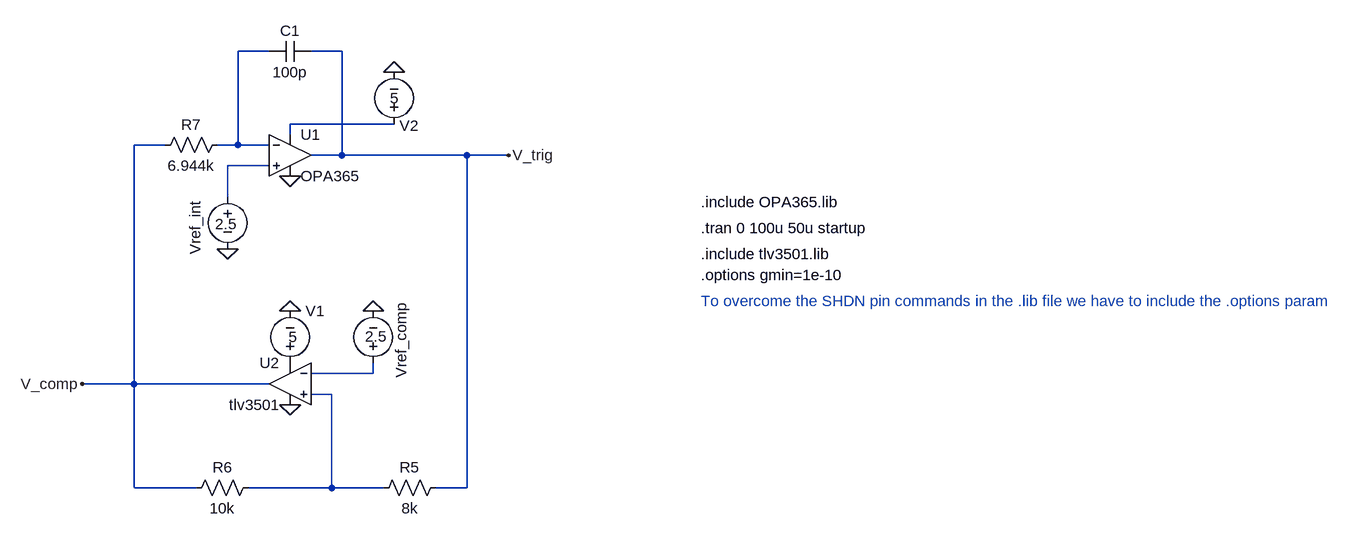
[diagram p0: schematic oscillator.asc]
oscillator.asc, the LTspice schematic file:
Version 4.1
SHEET 1 1908 680
WIRE 192 -64 144 -64
WIRE 304 -64 256 -64
WIRE 384 48 224 48
WIRE 224 64 224 48
WIRE 32 80 -16 80
WIRE 144 80 144 -64
WIRE 144 80 112 80
WIRE 192 80 144 80
WIRE 304 96 304 -64
WIRE 304 96 256 96
WIRE 496 96 304 96
WIRE 560 96 496 96
WIRE 192 112 128 112
WIRE 128 160 128 112
WIRE 352 432 352 416
WIRE 352 432 256 432
WIRE -16 448 -16 80
WIRE -16 448 -96 448
WIRE 192 448 -16 448
WIRE 288 464 256 464
WIRE -16 608 -16 448
WIRE 80 608 -16 608
WIRE 288 608 288 464
WIRE 288 608 160 608
WIRE 368 608 288 608
WIRE 496 608 496 96
WIRE 496 608 448 608
FLAG 224 336 0
FLAG 384 -32 0
FLAG 224 480 0
FLAG 352 336 0
FLAG 128 240 0
FLAG 560 96 V_trig
FLAG -96 448 V_comp
FLAG 224 128 0
SYMBOL voltage 224 432 M180
WINDOW 0 24 96 Left 2
WINDOW 3 -2 56 Left 2
WINDOW 123 0 0 Left 0
WINDOW 39 0 0 Left 0
SYMATTR InstName V1
SYMATTR Value 5
SYMBOL voltage 384 64 R180
WINDOW 0 -38 14 Left 2
WINDOW 3 -7 56 Left 2
WINDOW 123 0 0 Left 0
WINDOW 39 0 0 Left 0
SYMATTR InstName V2
SYMATTR Value 5
SYMBOL res 464 592 R90
WINDOW 0 0 56 VBottom 2
WINDOW 3 32 56 VTop 2
SYMATTR InstName R5
SYMATTR Value 8k
SYMBOL res 176 592 R90
WINDOW 0 0 56 VBottom 2
WINDOW 3 32 56 VTop 2
SYMATTR InstName R6
SYMATTR Value 10k
SYMBOL res 128 64 R90
WINDOW 0 0 56 VBottom 2
WINDOW 3 32 56 VTop 2
SYMATTR InstName R7
SYMATTR Value 6.944k
SYMBOL cap 256 -80 R90
WINDOW 0 0 32 VBottom 2
WINDOW 3 32 32 VTop 2
SYMATTR InstName C1
SYMATTR Value 100p
SYMBOL voltage 352 432 R180
WINDOW 0 -43 -7 VRight 2
WINDOW 3 -21 57 Left 2
WINDOW 123 0 0 Left 0
WINDOW 39 0 0 Left 0
SYMATTR InstName Vref_comp
SYMATTR Value 2.5
SYMBOL voltage 128 144 R0
WINDOW 0 -50 22 VRight 2
WINDOW 3 -19 58 Left 2
WINDOW 123 0 0 Left 0
WINDOW 39 0 0 Left 0
SYMATTR InstName Vref_int
SYMATTR Value 2.5
SYMBOL OpAmps\\opamp2 224 32 R0
SYMATTR InstName U1
SYMATTR Value OPA365
SYMBOL OpAmps\\opamp2 224 384 M0
SYMATTR InstName U2
SYMATTR Value tlv3501
TEXT 856 168 Left 2 !.include OPA365.lib
TEXT 856 248 Left 2 !.include tlv3501.lib
TEXT 856 208 Left 2 !.tran 0 100u 50u startup
TEXT 856 280 Left 2 !.options gmin=1e-10
TEXT 856 320 Left 2 ;To overcome the SHDN pin commands in the .lib file we have to include the .options param

The netlist it stands for:
* oscillator.asc
V1 P001 0 5
V2 N002 0 5
R5 V_trig N005 8k
R6 N005 V_comp 10k
R7 N001 V_comp 6.944k
C1 V_trig N001 100p
Vref_comp N004 0 2.5
Vref_int N003 0 2.5
X§U1 N003 N001 N002 0 V_trig OPA365  ; pins In+ In- V+ V- OUT
X§U2 N005 N004 P001 0 V_comp tlv3501  ; pins In+ In- V+ V- OUT
.include OPA365.lib
.include tlv3501.lib
.tran 0 100u 50u startup
.options gmin=1e-10
* To overcome the SHDN pin commands in the .lib file we have to include the .options param
.backanno
.end